# Altium project ESC.PrjPcb
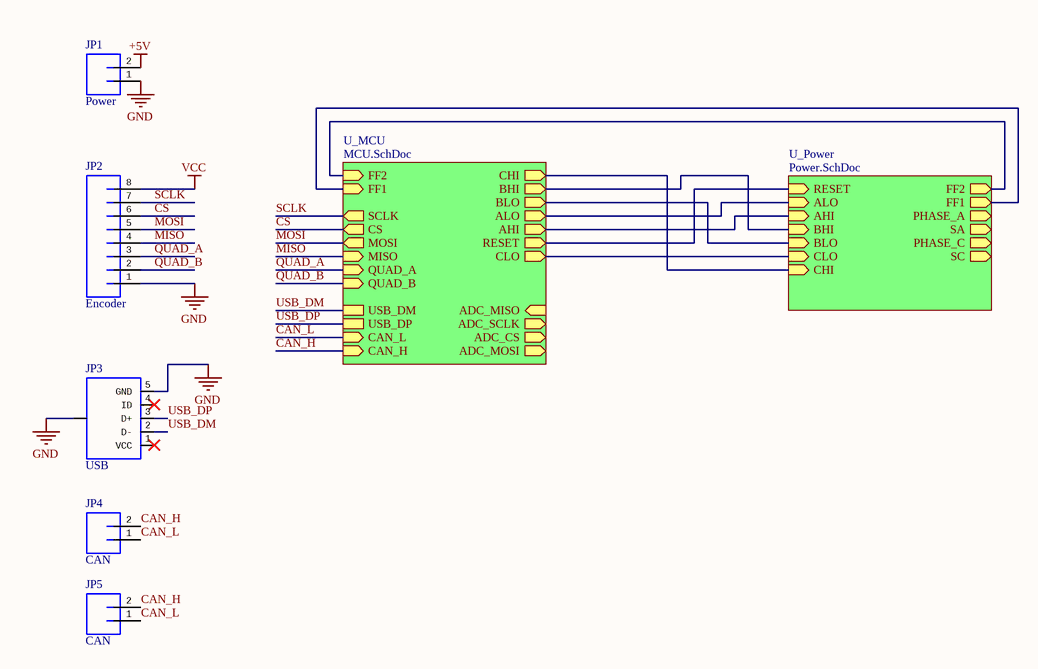
[diagram p0: ESC.SchDoc]
4 sheets, 85 parts. Net scope: hierarchical (ports join the sheet entries above them; power ports are global).
Board file: ESC.PcbDoc
Sheets:
  ESC.SchDoc
    U_Power = Power.SchDoc
    U_MCU = MCU.SchDoc
  ADC.SchDoc

## Sheet ESC.SchDoc
size A

### Parts
JP1  Power  [JST-2-PTH-VERT]
JP2  Encoder  [JST-8-PTH-VERT]
JP3  USB  [USB-MICROB]
JP4  CAN  [JST-2-PTH-VERT]
JP5  CAN  [JST-2-PTH-VERT]

### Sub-sheets
U_MCU = MCU.SchDoc: CHI (out), BHI (out), BLO (out), FF2 (in), FF1 (in), ALO (out), AHI (out), RESET (out), CLO (out), MISO (in), SCLK (out), CS (out), QUAD_A (in), QUAD_B (in), MOSI (out), ADC_MISO (in), ADC_SCLK (out), ADC_CS (out), ADC_MOSI (out), USB_DM, USB_DP, CAN_L (in), CAN_H (in)
U_Power = Power.SchDoc: RESET (in), FF2 (out), ALO (in), FF1 (out), AHI (in), BHI (in), BLO (in), CLO (in), CHI (in), PHASE_A (out), SA (out), SC (out), PHASE_C (out)

### Nets
+5V: JP1.2
GND: JP1.1 JP2.1 JP3.5(GND) JP3.6(SHIELD)
VCC: JP2.8
CAN_H: JP4.2 JP5.2 ; sheet U_MCU/CAN_H
CAN_L: JP4.1 JP5.1 ; sheet U_MCU/CAN_L
CS: JP2.6 ; sheet U_MCU/CS
MISO: JP2.4 ; sheet U_MCU/MISO
MOSI: JP2.5 ; sheet U_MCU/MOSI
QUAD_A: JP2.3 ; sheet U_MCU/QUAD_A
QUAD_B: JP2.2 ; sheet U_MCU/QUAD_B
SCLK: JP2.7 ; sheet U_MCU/SCLK
USB_DM: JP3.2(D-) ; sheet U_MCU/USB_DM
USB_DP: JP3.3(D+) ; sheet U_MCU/USB_DP
NetU1_2: sheet U_Power/RESET, sheet U_MCU/RESET
NetU1_4: sheet U_Power/FF2, sheet U_MCU/FF2
NetU1_5: sheet U_Power/FF1, sheet U_MCU/FF1
NetU1_6: sheet U_Power/ALO, sheet U_MCU/ALO
NetU1_7: sheet U_Power/AHI, sheet U_MCU/AHI
NetU1_8: sheet U_Power/BHI, sheet U_MCU/BHI
NetU1_9: sheet U_Power/BLO, sheet U_MCU/BLO
NetU1_10: sheet U_Power/CLO, sheet U_MCU/CLO
NetU1_11: sheet U_Power/CHI, sheet U_MCU/CHI

Not connected (* = marked no-connect by the designer): JP3 1(VCC)* 4(ID)*

### Library data of the parts
JP1 JP4 JP5 = JST_2_VERT
JP2 = JST_8_VERT
JP3 = USB_MICROB_PLUG-SMT: pin to pad: 1>VBUS 2>D- 3>D+ 4>ID 5>GND 6>MT1+P$1+P$2+MT2; PROD_ID: CONN-09900

## Sheet Power.SchDoc
size A
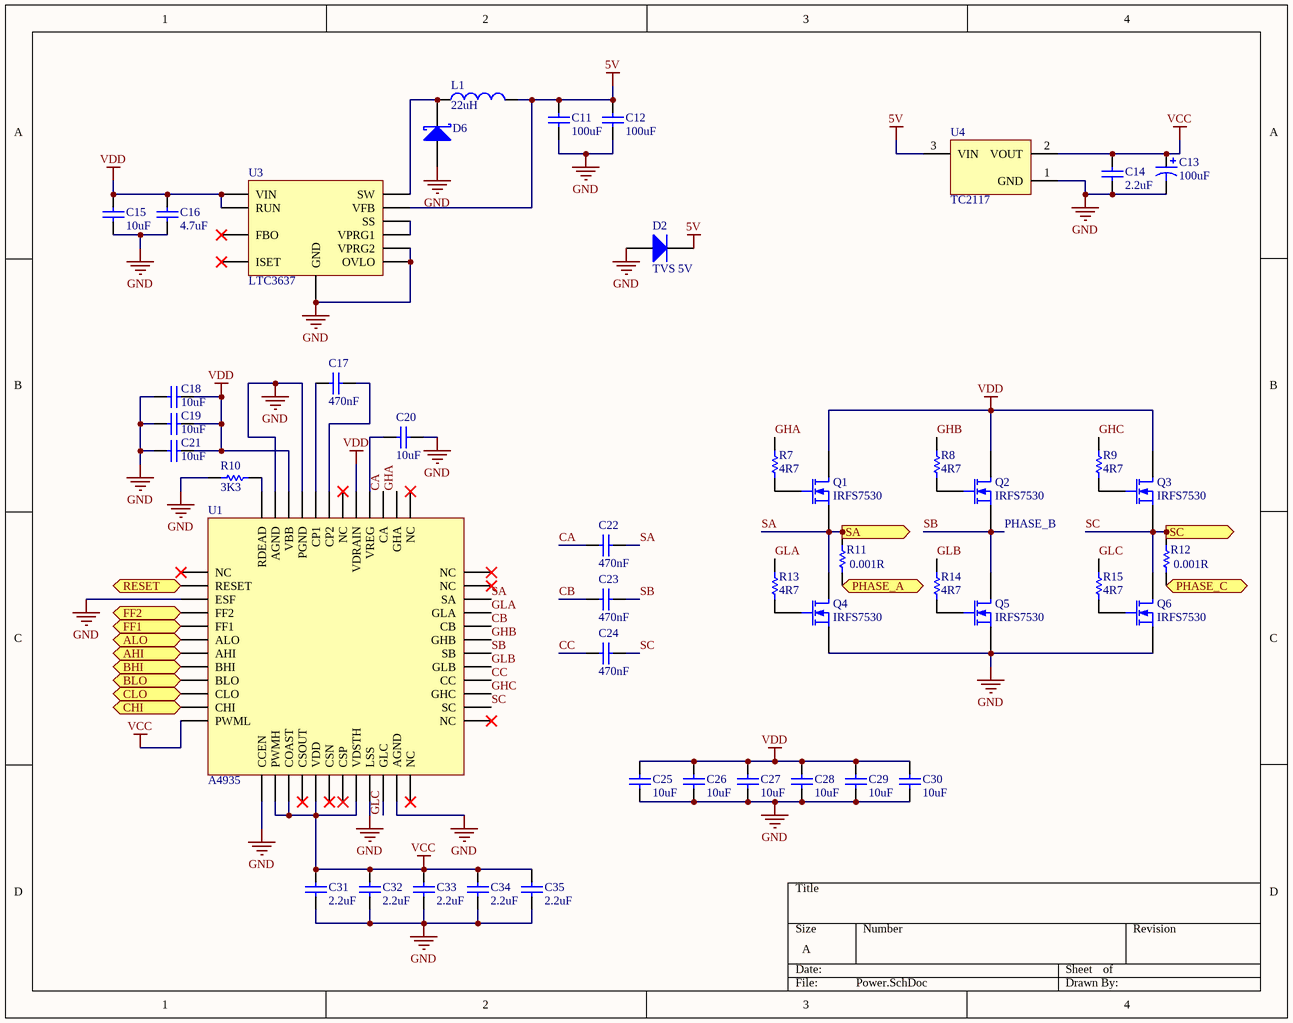
[diagram p1: Power.SchDoc]

### Parts
C11  100uF  [CAPC1210(3225)280_N]
C12  100uF  [CAPC1210(3225)280_N]
C13  100uF  [AVX-CAPC7343_V]
C14  2.2uF  [CAPC0603(1608)55_N]
C15  10uF  [CAPC1206(3216)190_M]
C16  4.7uF  [CAPC0805(2012)145_N]
C17  470nF  [CAPC0603(1608)100_N]
C18  10uF  [CAPC1206(3216)190_M]
C19  10uF  [CAPC1206(3216)190_M]
C20  10uF  [CAPC0805(2012)145_N]
C21  10uF  [CAPC1206(3216)190_M]
C22  470nF  [CAPC0603(1608)100_L]
C23  470nF  [CAPC0603(1608)100_L]
C24  470nF  [CAPC0603(1608)100_L]
C25  10uF  [CAPC1206(3216)190_M]
C26  10uF  [CAPC1206(3216)190_M]
C27  10uF  [CAPC1206(3216)190_M]
C28  10uF  [CAPC1206(3216)190_M]
C29  10uF  [CAPC1206(3216)190_M]
C30  10uF  [CAPC1206(3216)190_M]
C31  2.2uF  [CAPC0603(1608)55_N]
C32  2.2uF  [CAPC0603(1608)55_N]
C33  2.2uF  [CAPC0603(1608)55_N]
C34  2.2uF  [CAPC0603(1608)55_N]
C35  2.2uF  [CAPC0603(1608)55_N]
D2  TVS 5V  [VISH-DO-214AC-2_N]
D6  (no value)  [SMB]
L1  value 22uH  [SDR0805-180ML]  (hidden comment: SDR0805-180ML)
Q1  IRFS7530  [DPAK127P1525X483-7N]
Q2  IRFS7530  [DPAK127P1525X483-7N]
Q3  IRFS7530  [DPAK127P1525X483-7N]
Q4  IRFS7530  [DPAK127P1525X483-7N]
Q5  IRFS7530  [DPAK127P1525X483-7N]
Q6  IRFS7530  [DPAK127P1525X483-7N]
R7  4R7  [RESC0603(1608)_N]
R8  4R7  [RESC0603(1608)_N]
R9  4R7  [RESC0603(1608)_N]
R10  3K3  [RESC0603(1608)_N]
R11  value 0.001R  [Shunt]
R12  value 0.001R  [Shunt]
R13  4R7  [RESC0603(1608)_N]
R14  4R7  [RESC0603(1608)_N]
R15  4R7  [RESC0603(1608)_N]
U1  A4935  [LQFP-48]
U3  LTC3637  [SON50P300X85_HS-17N]
U4  TC2117  [SOT-223-DB3_M]

### Ports
AHI (in), ALO (in), BHI (in), BLO (in), CHI (in), CLO (in), FF1 (out), FF2 (out), PHASE_A (out), PHASE_C (out), RESET (in), SA (out), SC (out)

### Nets
5V: C11.2 C12.2 D2.1(K) L1.2 U3.9(VFB) U4.3(VIN)
GND: C11.1 C12.1 C13.2 C14.2 C15.1 C16.2 C18.1 C19.1 C20.2 C21.1 C25.1 C26.1 C27.1 C28.1 C29.1 C30.1 C31.1 C32.1 C33.1 C34.1 C35.1 D2.2(A) D6.1(A) Q4.3(S) Q5.3(S) Q6.3(S) R10.1 U1.3(ESF) U1.13(CCEN) U1.21(LSS) U1.23(AGND) U1.45(PGND) U1.47(AGND) U3.6(VPRG2) U3.12(OVLO) U3.17(GND) U4.1(GND)
VCC: C13.1 C14.1 C31.2 C32.2 C33.2 C34.2 C35.2 U1.12(PWML) U1.14(PWMH) U1.15(COAST) U1.17(VDD) U1.20(VDSTH) U4.2(VOUT)
VDD: C15.2 C16.1 C18.2 C19.2 C21.2 C25.2 C26.2 C27.2 C28.2 C29.2 C30.2 Q1.1(D) Q2.1(D) Q3.1(D) U1.41(VDRAIN) U1.46(VBB) U3.3(VIN) U3.14(RUN)
CA: C22.1 U1.39(CA)
CB: C23.1 U1.32(CB)
CC: C24.1 U1.28(CC)
GHA: R7.2 U1.38(GHA)
GHB: R8.2 U1.31(GHB)
GHC: R9.2 U1.27(GHC)
GLA: R13.2 U1.33(GLA)
GLB: R14.2 U1.29(GLB)
GLC: R15.2 U1.22(GLC)
SA: C22.2 Q1.3(S) Q4.1(D) R11.2 U1.34(SA) ; port SA
SB: C23.2 Q2.3(S) Q5.1(D) U1.30(SB)
SC: C24.2 Q3.3(S) Q6.1(D) R12.2 U1.26(SC) ; port SC
NetC17_1: C17.1 U1.44(CP1)
NetC17_2: C17.2 U1.43(CP2)
NetC20_1: C20.1 U1.40(VREG)
NetD6_2: D6.2(K) L1.1 U3.1(SW)
NetQ1_2: Q1.2(G) R7.1
NetQ2_2: Q2.2(G) R8.1
NetQ3_2: Q3.2(G) R9.1
NetQ4_2: Q4.2(G) R13.1
NetQ5_2: Q5.2(G) R14.1
NetQ6_2: Q6.2(G) R15.1
NetR10_2: R10.2 U1.48(RDEAD)
NetR11_1: R11.1 ; port PHASE_A
NetR12_1: R12.1 ; port PHASE_C
NetU1_2: U1.2(RESET) ; port RESET
NetU1_4: U1.4(FF2) ; port FF2
NetU1_5: U1.5(FF1) ; port FF1
NetU1_6: U1.6(ALO) ; port ALO
NetU1_7: U1.7(AHI) ; port AHI
NetU1_8: U1.8(BHI) ; port BHI
NetU1_9: U1.9(BLO) ; port BLO
NetU1_10: U1.10(CLO) ; port CLO
NetU1_11: U1.11(CHI) ; port CHI
NetU3_7: U3.7(VPRG1) U3.10(SS)

Not connected (* = marked no-connect by the designer): U1 1(NC)* 16(CSOUT)* 18(CSN)* 19(CSP)* 24(NC)* 25(NC)* 35(NC)* 36(NC)* 37(NC)* 42(NC)*; U3 5(FBO)* 11(ISET)*

### Notes on the sheet
- (near Q2) PHASE_B

### Library data of the parts
C11 C12 = CMP-1038-02301-1: CAP 100uF 10V Â±10% 1210 (3225 Metric) Thickness 2.8mm SMD; Case-EIA: 1210; Case-Metric: 3225; Rated Voltage: 6.3 V; Value: 100uF; Tolerance: Â±10%; Technology: SMT; Max Thickness: 2.8 mm
C13 = AVX-CAP-P-2
C14 C31-C35 = CMP-1035-02762-1: CAP 2.2uF 16V Â±10% 0603 (1608 Metric) Thickness 0.55mm SMD; Case-EIA: 0603; Case-Metric: 1608; Max Thickness: 0.55 mm; Technology: SMT; Value: 2.2uF; Rated Voltage: 16 V; Tolerance: Â±10%
C15 C18 C19 C21 C25-C30 = CMP-1037-04982-1: CAP 10uF 50V Â±10% 1206 (3216 Metric) Thickness 1.9mm SMD; Case-EIA: 1206; Case-Metric: 3216; Technology: SMT; Tolerance: Â±10%; Max Thickness: 1.9 mm; Value: 10uF; Rated Voltage: 50 V
C16 = CMP-1036-04900-1: CAP 4.7uF 50V Â±10% 0805 (2012 Metric) Thickness 1.45mm SMD; Case-Metric: 2012; Case-EIA: 0805; Value: 4.7uF; Tolerance: Â±10%; Technology: SMT; Max Thickness: 1.45 mm; Rated Voltage: 50 V
C17 = CMP-1035-02704-1: CAP 470nF 25V Â±20% 0603 (1608 Metric) Thickness 1mm SMD; Case-Metric: 1608; Case-EIA: 0603; Technology: SMT; Rated Voltage: 25 V; Max Thickness: 1 mm; Value: 470nF; Tolerance: Â±20%
C20 = CMP-1036-04932-1: CAP 10uF 25V Â±10% 0805 (2012 Metric) Thickness 1.45mm SMD; Case-EIA: 0805; Case-Metric: 2012; Technology: SMT; Value: 10uF; Rated Voltage: 25 V; Max Thickness: 1.45 mm; Tolerance: Â±10%
C22-C24 = CMP-1035-02703-1: CAP 470nF 25V Â±10% 0603 (1608 Metric) Thickness 1mm SMD; Case-Metric: 1608; Case-EIA: 0603; Tolerance: Â±10%; Rated Voltage: 25 V; Max Thickness: 1 mm; Technology: SMT; Value: 470nF
D2 = CMP-0548-00235-1: Transient Voltage Suppressor, 6.40 to 231 V, 5 V Stand-off Voltage, Uni-Directional, -55 to 155 degC, 2-pin DO-214AC, Pb-Free, Tape and Reel; PartNumber: SMAJ5.0A-E3/61; Manufacturer: Vishay Semiconductor; ID (uA): 800; IFSM: 40 A; VBR Uni-Directional (V): 6.4 to 231; PPPM (W): 400, 300; VWM (V): 5; PackageDescription: 2-Pin DO-214AC (SMA), Body 4.245 x 2.665 mm; Mounting Technology: Surface Mount; ComponentLink3Description: Package Specification; ComponentLink1URL: http://www.vishay.com/; Operating Junction and Storage Temperature Range: -55 to 150 degC; PackageReference: DO-214AC-2; ComponentLink2URL: http://www.vishay.com/docs/88390/smaj50a.pdf; Packing: Tape and Reel; RoHS: TRUE; DatasheetVersion: 12/8/2013; ComponentLink3URL: http://www.vishay.com/docs/88390/smaj50a.pdf; ComponentLink1Description: Manufacturer URL; ComponentLink2Description: Datasheet
D6 = D Schottky: Schottky Diode; Published: 8-Jun-2000; LatestRevisionDate: 17-Jul-2002; LatestRevisionNote: Re-released for DXP Platform.; PackageReference: SMB; Publisher: Altium Limited; PackageDescription: DO-214-AA/SMB; 2 C-Bend Leads; Body 5.3 x 3.6 mm, inc. leads (LxW); Code_JEDEC: DO-214-AA
L1 = SDR0805-180ML: Inductor; Code_IEC: 1005; Published: 8-Jun-2000; LatestRevisionDate: 29-May-2009; LatestRevisionNote: IPC-7351 Footprint Added.; PackageReference: 0402-A; Publisher: Altium Limited; PackageDescription: Chip Inductor; Code_JEITA: 0402
Q1-Q6 = IRFS7530: N-Channel MOSFET; pin to pad: 1>8 2>1 3>2+3+5+6+7; Published: 8-Jun-2000; LatestRevisionDate: 17-Jul-2002; LatestRevisionNote: Re-released for DXP Platform.; PackageVersion: 1995/1996; PackageReference: E3; Publisher: Altium Limited; PackageDescription: TO, Flat Index; 3 In-Line, Axial Leads; Body Dia. 4.6mm; Lead Dia. 0.5 mm (max)
R7-R9 R13-R15 = CMP-1012-00018-1: 4R7 0.1W 5% 0603 (1608 Metric)  SMD; Value: 4.70 Ohm; Case-EIA: 0603; Case-Metric: 1608; Power: 0.1 W; Tolerance: 5 %; Technology: SMT
R10 = CMP-1012-00086-1: 3K3 0.1W 5% 0603 (1608 Metric)  SMD; Case-EIA: 0603; Value: 3300.00 Ohm; Case-Metric: 1608; Technology: SMT; Tolerance: 5 %; Power: 0.1 W
R11 = Shunt: 0.001R; Published: 8-Jun-2000; LatestRevisionDate: 17-Jul-2002; LatestRevisionNote: Re-released for DXP Platform.; PackageReference: AXIAL-0.3; Publisher: Altium Limited; PackageDescription: Axial Device, Thru-Hole; 2 Leads; 0.3 in Pin Spacing
R12 = Shunt: Resistor; Published: 8-Jun-2000; LatestRevisionDate: 17-Jul-2002; LatestRevisionNote: Re-released for DXP Platform.; PackageReference: AXIAL-0.3; Publisher: Altium Limited; PackageDescription: Axial Device, Thru-Hole; 2 Leads; 0.3 in Pin Spacing
U1 = A4935: pin to pad: 23>23+47+49 47>47+23+49
U3 = LTC3637: pin to pad: 17>8+16+17
U4 = PM-LINEREG-TC2117-IL4: pin to pad: 2>2+4

## Sheet MCU.SchDoc
size A
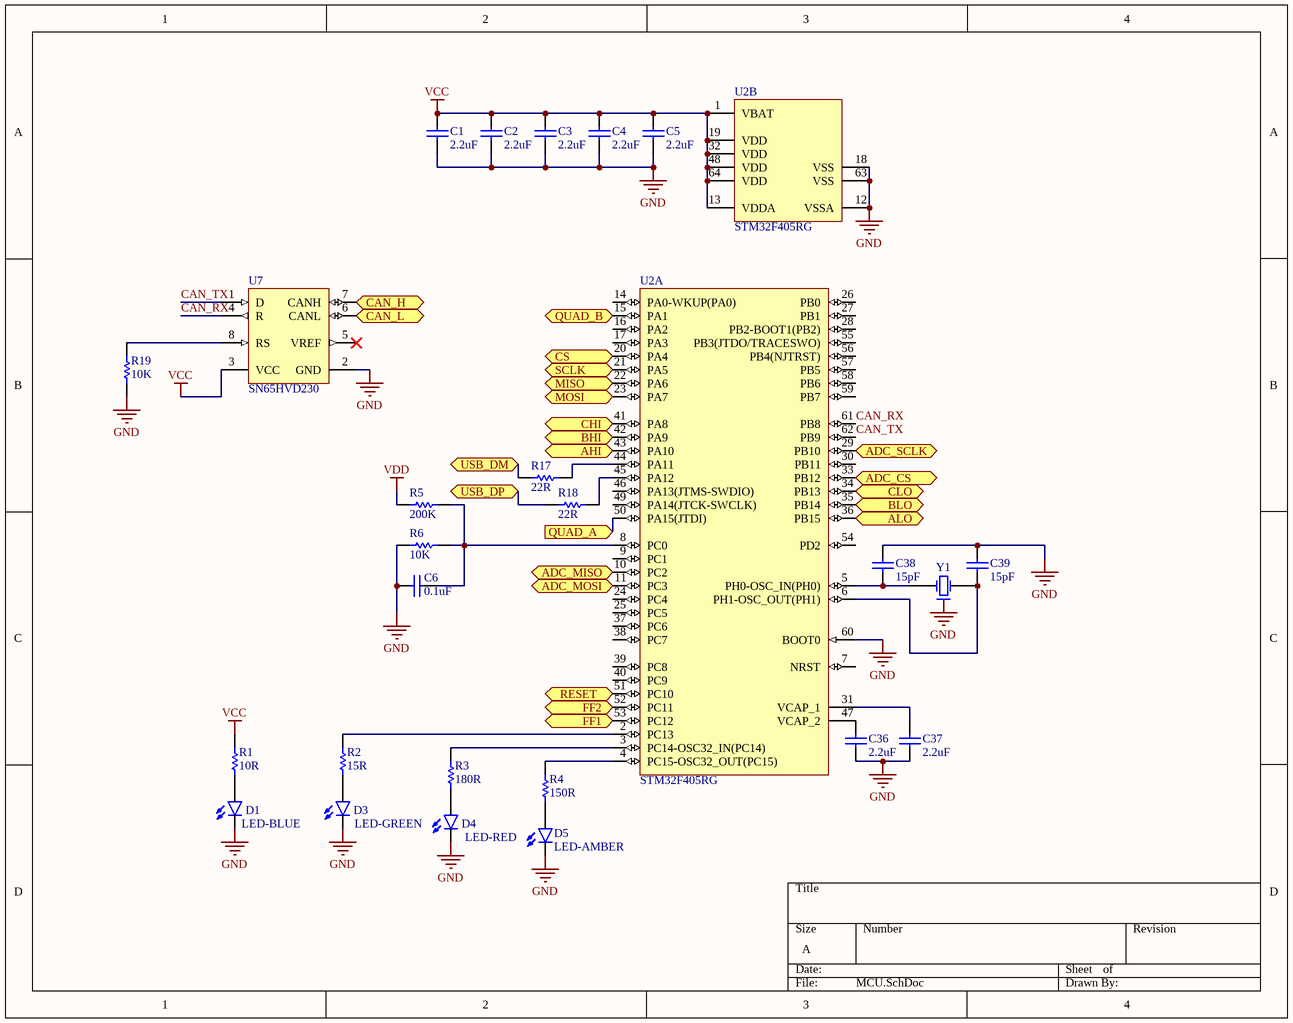
[diagram p2: MCU.SchDoc]

### Parts
C1  2.2uF  [CAPC0603(1608)55_N]
C2  2.2uF  [CAPC0603(1608)55_N]
C3  2.2uF  [CAPC0603(1608)55_N]
C4  2.2uF  [CAPC0603(1608)55_N]
C5  2.2uF  [CAPC0603(1608)55_N]
C6  0.1uF  [CAPC0603(1608)100_L]
C36  2.2uF  [CAPC0603(1608)55_N]
C37  2.2uF  [CAPC0603(1608)55_N]
C38  15pF  [CAPC0603(1608)100_M]
C39  15pF  [CAPC0603(1608)100_M]
D1  LED-BLUE  [LED-1206]
D3  LED-GREEN  [LED-1206]
D4  LED-RED  [LED-1206]
D5  LED-AMBER  [LED-1206]
R1  10R  [RESC0603(1608)_N]
R2  15R  [RESC0603(1608)_N]
R3  180R  [RESC0603(1608)_N]
R4  150R  [RESC0603(1608)_N]
R5  200K  [RESC0603(1608)_N]
R6  10K  [RESC0603(1608)_N]
R17  22R  [RESC0603(1608)_N]
R18  22R  [RESC0603(1608)_N]
R19  10K  [RESC0603(1608)_N]
U2  STM32F405RG  (parts A,B of 2)
U7  SN65HVD230  [D8_M]
Y1  (no value)  [ABRA-ABM3B-4_V]

### Ports
ADC_CS (out), ADC_MISO (in), ADC_MOSI (out), ADC_SCLK (out), AHI (out), ALO (out), BHI (out), BLO (out), CAN_H (in), CAN_L (in), CHI (out), CLO (out), CS (out), FF1 (in), FF2 (in), MISO (in), MOSI (out), QUAD_A (in), QUAD_B (in), RESET (out), SCLK (out), USB_DM, USB_DP

### Nets
GND: C1.1 C2.1 C3.1 C4.1 C5.1 C6.1 C36.1 C37.1 C38.2 C39.2 D1.C D3.C D4.C D5.C R6.1 R19.1 U2.12(VSSA) U2.18(VSS) U2.60(BOOT0) U2.63(VSS) U7.2(GND) Y1.2
VCC: C1.2 C2.2 C3.2 C4.2 C5.2 R1.2 U2.1(VBAT) U2.13(VDDA) U2.19(VDD) U2.32(VDD) U2.48(VDD) U2.64(VDD) U7.3(VCC)
VDD: R5.1
CAN_H: U7.7(CANH) ; port CAN_H
CAN_L: U7.6(CANL) ; port CAN_L
CAN_RX: U2.61(PB8) U7.4(R)
CAN_TX: U2.62(PB9) U7.1(D)
CS: U2.20(PA4) ; port CS
MISO: U2.22(PA6) ; port MISO
MOSI: U2.23(PA7) ; port MOSI
QUAD_A: U2.50(PA15(JTDI)) ; port QUAD_A
QUAD_B: U2.15(PA1) ; port QUAD_B
SCLK: U2.21(PA5) ; port SCLK
USB_DM: R17.1 ; port USB_DM
USB_DP: R18.1 ; port USB_DP
NetC6_2: C6.2 R5.2 R6.2 U2.8(PC0)
NetC36_2: C36.2 U2.47(VCAP_2)
NetC37_2: C37.2 U2.31(VCAP_1)
NetC38_1: C38.1 U2.5(PH0-OSC_IN(PH0)) Y1.1(X1)
NetC39_1: C39.1 U2.6(PH1-OSC_OUT(PH1)) Y1.3(X2)
NetD1_A: D1.A R1.1
NetD3_A: D3.A R2.1
NetD4_A: D4.A R3.1
NetD5_A: D5.A R4.1
NetR2_2: R2.2 U2.2(PC13)
NetR3_2: R3.2 U2.3(PC14-OSC32_IN(PC14))
NetR4_2: R4.2 U2.4(PC15-OSC32_OUT(PC15))
NetR17_2: R17.2 U2.44(PA11)
NetR18_2: R18.2 U2.45(PA12)
NetR19_2: R19.2 U7.8(RS)
NetU1_2: U2.51(PC10) ; port RESET
NetU1_4: U2.52(PC11) ; port FF2
NetU1_5: U2.53(PC12) ; port FF1
NetU1_6: U2.36(PB15) ; port ALO
NetU1_7: U2.43(PA10) ; port AHI
NetU1_8: U2.42(PA9) ; port BHI
NetU1_9: U2.35(PB14) ; port BLO
NetU1_10: U2.34(PB13) ; port CLO
NetU1_11: U2.41(PA8) ; port CHI
NetU2_10: U2.10(PC2) ; port ADC_MISO
NetU2_11: U2.11(PC3) ; port ADC_MOSI
NetU2_29: U2.29(PB10) ; port ADC_SCLK
NetU2_33: U2.33(PB12) ; port ADC_CS

Not connected (* = marked no-connect by the designer): U2 7(NRST) 9(PC1) 14(PA0-WKUP(PA0)) 16(PA2) 17(PA3) 24(PC4) 25(PC5) 26(PB0) 27(PB1) 28(PB2-BOOT1(PB2)) 30(PB11) 37(PC6) 38(PC7) 39(PC8) 40(PC9) 46(PA13(JTMS-SWDIO)) 49(PA14(JTCK-SWCLK)) 54(PD2) 55(PB3(JTDO/TRACESWO)) 56(PB4(NJTRST)) 57(PB5) 58(PB6) 59(PB7); U7 5(VREF)*

### Library data of the parts
C1-C5 C36 C37 = CMP-1035-02762-1: as C14 on sheet Power; Max Thickness: 0.55 mm; Technology: SMT; Value: 2.2uF; Rated Voltage: 16 V; Tolerance: Â±10%
C6 = CMP-1035-02591-1: CAP 100nF 50V Â±5% 0603 (1608 Metric) Thickness 1mm SMD; Case-Metric: 1608; Case-EIA: 0603; Rated Voltage: 50 V; Max Thickness: 1 mm; Tolerance: Â±5%; Technology: SMT; Value: 100nF
C38 C39 = CMP-1035-00686-1: CAP 15pF 100V Â±0.25pF 0603 (1608 Metric) Thickness 1mm SMD; Case-Metric: 1608; Case-EIA: 0603; Rated Voltage: 100 V; Max Thickness: 1 mm; Value: 15pF; Tolerance: Â±0.25pF; Technology: SMT
D1 = LED-BLUE1206: PROD_ID: DIO-09911
D3 = LED-GREEN1206: PROD_ID: DIO-00862
D4 = LED-RED1206: PROD_ID: DIO-09912
D5 = LED-AMBER1206
R1 = CMP-1012-00026-1: 10R 0.1W 5% 0603 (1608 Metric)  SMD; Case-Metric: 1608; Case-EIA: 0603; Value: 10.00 Ohm; Technology: SMT; Tolerance: 5 %; Power: 0.1 W
R2 = CMP-1012-00030-1: 15R 0.1W 5% 0603 (1608 Metric)  SMD; Case-EIA: 0603; Case-Metric: 1608; Value: 15.00 Ohm; Tolerance: 5 %; Technology: SMT; Power: 0.1 W
R3 = CMP-1012-00056-1: 180R 0.1W 5% 0603 (1608 Metric)  SMD; Value: 180.00 Ohm; Case-EIA: 0603; Case-Metric: 1608; Power: 0.1 W; Technology: SMT; Tolerance: 5 %
R4 = CMP-1012-00054-1: 150R 0.1W 5% 0603 (1608 Metric)  SMD; Case-EIA: 0603; Value: 150.00 Ohm; Case-Metric: 1608; Power: 0.1 W; Tolerance: 5 %; Technology: SMT
R5 = CMP-1012-00129-1: 200K 0.1W 5% 0603 (1608 Metric)  SMD; Case-EIA: 0603; Value: 200000.00 Ohm; Case-Metric: 1608; Technology: SMT; Power: 0.1 W; Tolerance: 5 %
R6 R19 = CMP-1012-00098-1: 10K 0.1W 5% 0603 (1608 Metric)  SMD; Case-EIA: 0603; Value: 10000.00 Ohm; Case-Metric: 1608; Technology: SMT; Tolerance: 5 %; Power: 0.1 W
R17 R18 = CMP-1012-00034-1: 22R 0.1W 5% 0603 (1608 Metric)  SMD; Value: 22.00 Ohm; Case-EIA: 0603; Case-Metric: 1608; Technology: SMT; Power: 0.1 W; Tolerance: 5 %
U2 = MC-ARM-STM32F4X5-SQ64
U7 = CMP-0315-00015-1: 3.3V CAN Transceiver with Standby Mode, 17 mA, -40 to 85 degC, 8-pin SOIC (D), Green (RoHS & no Sb/Br); Manufacturer: Texas Instruments; PartNumber: SN65HVD230DR; ICC(Max)(mA): 17; Supply Voltage(s)(V): 3.3; Drivers Per Package: 1; Transient Pulse Protection(V): -25 to 25; Rating: Catalog; Code_JEDEC: MS-012AA; Low Power Mode: Standby; PackageDescription: 8-Pin Plastic Small Outline Integrated Circuit, 4.9 x 3.9 mm, Pitch 1.27 mm Pitch; PackageReference: D8; DatasheetVersion: SLOS346K; Isolated: No; Receivers Per Package: 1; PackageVersion: revM, Jun-2011; Eco-Plan: Green (RoHS & no Sb/Br); SubFamily: CAN; ComponentLink1Description: Datasheet; Footprint: PCA82C250; Mounting Technology: Surface Mount; ComponentLink1URL: http://www.ti.com/general/docs/lit/getliterature.tsp?genericPartNumber=SN65HVD230&fileType=pdf
Y1 = ABRA-ABM3B-4

## Sheet ADC.SchDoc
size A
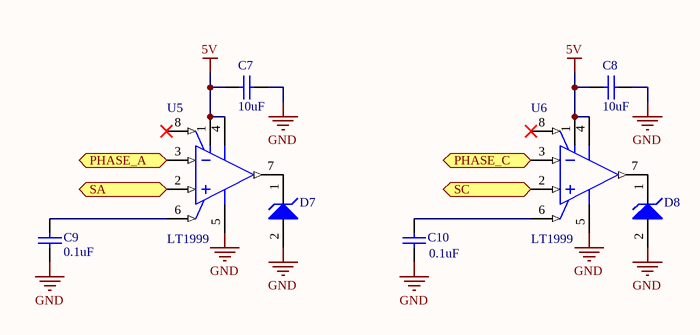
[diagram p3: ADC.SchDoc]

### Parts
C7  10uF  [CAPC0603(1608)100_M]
C8  10uF  [CAPC0603(1608)100_N]
C9  0.1uF  [CAPC0603(1608)100_L]
C10  0.1uF  [CAPC0603(1608)100_L]
D7  (no value)  [ONSC-SOD-323-2-477-02_V]
D8  (no value)  [ONSC-SOD-323-2-477-02_V]
U5  LT1999  [LT-MS8-8_N]
U6  LT1999  [LT-MS8-8_N]

### Ports
PHASE_A (in), PHASE_C (in), SA (in), SC (in)

### Nets
5V: C7.1 C8.1 U5.1(V+) U5.4(V+) U6.1(V+) U6.4(V+)
GND: C7.2 C8.2 C9.1 C10.1 D7.2(A) D8.2(A) U5.5(GND) U6.5(GND)
NetC9_2: C9.2 U5.6(REF)
NetC10_2: C10.2 U6.6(REF)
NetD7_1: D7.1(K) U5.7(OUT)
NetD8_1: D8.1(K) U6.7(OUT)
NetU5_2: U5.2(+IN) ; port SA
NetU5_3: U5.3(-IN) ; port PHASE_A
NetU6_2: U6.2(+IN) ; port SC
NetU6_3: U6.3(-IN) ; port PHASE_C

Not connected (* = marked no-connect by the designer): U5 8(~{SHDN})*; U6 8(~{SHDN})*

### Library data of the parts
C7 = CMP-1035-02796-1: CAP 10uF 6.3V Â±10% 0603 (1608 Metric) Thickness 1mm SMD; Case-EIA: 0603; Case-Metric: 1608; Tolerance: Â±10%; Value: 10uF; Technology: SMT; Rated Voltage: 6.3 V; Max Thickness: 1 mm
C8 = CMP-1035-02797-1: CAP 10uF 6.3V Â±20% 0603 (1608 Metric) Thickness 1mm SMD; Case-Metric: 1608; Case-EIA: 0603; Value: 10uF; Technology: SMT; Tolerance: Â±20%; Max Thickness: 1 mm; Rated Voltage: 6.3 V
C9 C10 = CMP-1035-02577-1: CAP 100nF 6.3V Â±20% 0603 (1608 Metric) Thickness 1mm SMD; Case-EIA: 0603; Case-Metric: 1608; Technology: SMT; Rated Voltage: 6.3 V; Value: 100nF; Max Thickness: 1 mm; Tolerance: Â±20%
D7 D8 = CMP-1060-00652-1: Zener Voltage Regulator, 300 mW, Tight Tolerance Portfolio, 2-Pin SOD-323, Pb-Free, Tape and Reel; PartNumber: MM3Z3V3ST1G; Manufacturer: On Semiconductor; P Max (W): 0.3; DatasheetVersion: Rev. 21; PackageVersion: Rev. H, 03/2007; Packing: Tape and Reel; PackageReference: SOD-323-2-477-02; RoHS: Pb-Free; Mounting Technology: Surface Mount; ComponentLink2URL: http://www.onsemi.cn/pub_link/Collateral/MM3Z2V4ST1-D.PDF; ComponentLink1URL: http://www.onsemi.com/; ComponentLink2Description: Datasheet; ComponentLink1Description: Manufacturer URL; ComponentLink3Description: Package Specification; PackageDescription: 2-Pin SOD, Body 1.7 x 1.25 mm; ComponentLink3URL: http://www.onsemi.com/pub_link/Collateral/477-02.PDF.1
U5 U6 = CMP-0359-00619-2: Single Channel, High Voltage, Bidirectional Current Sense Amplifier, 2 MHz Typical GBW, 3 V/us Typical SR, 4.5 to 5.5 V, 8-Pin SOP (MS8-8), High Temperature / Automotive, Pb-Free, Reel; Manufacturer: Linear Technology; PartNumber: LT1999HMS8-20#TRPBF; Linear Technology Part Number: LT1999-20; Is (mA) Typical: 1.55; SR (V/us) Typical: 3; Channels (#): 1; Vs Max (V): 5.5; GBW (MHz) Typical: 2; Vs Min (V): 4.5; Vos (mV) Typical: 0.5; ComponentLink2Description: Datasheet; DatasheetVersion: Rev. B; PackageVersion: Rev G; ComponentLink3Description: Package Specification; ComponentLink2URL: http://cds.linear.com/docs/en/datasheet/1999fb.pdf; PackageReference: LT-MS8-8; PackageDescription: 8-Lead Plastic Small Outline, Body 3.9 x 4.9 mm, Pitch 1.27 mm; RevisionNote: URLs updated; Type: CSA; RoHS: Pb-Free; ComponentLink1URL: http://www.linear.com/; Packing: Reel; ComponentLink3URL: http://cds.linear.com/docs/en/packaging/05081610_G_SO8.pdf; ComponentLink1Description: Manufacturer URL; Mounting Technology: Surface Mount

## Nets that join several sheets
5V: Power (6 pins), ADC (6 pins)
GND: ESC (JP1.1 JP2.1 JP3.5 JP3.6), Power (37 pins), MCU (22 pins), ADC (8 pins)
VCC: ESC (JP2.8), Power (13 pins), MCU (13 pins)
VDD: Power (18 pins), MCU (R5.1)
CAN_H: ESC (JP4.2 JP5.2), MCU (U7.7)
CAN_L: ESC (JP4.1 JP5.1), MCU (U7.6)
CS: ESC (JP2.6), MCU (U2.20)
MISO: ESC (JP2.4), MCU (U2.22)
MOSI: ESC (JP2.5), MCU (U2.23)
NetU1_2: Power (U1.2), MCU (U2.51)
NetU1_4: Power (U1.4), MCU (U2.52)
NetU1_5: Power (U1.5), MCU (U2.53)
NetU1_6: Power (U1.6), MCU (U2.36)
NetU1_7: Power (U1.7), MCU (U2.43)
NetU1_8: Power (U1.8), MCU (U2.42)
NetU1_9: Power (U1.9), MCU (U2.35)
NetU1_10: Power (U1.10), MCU (U2.34)
NetU1_11: Power (U1.11), MCU (U2.41)
QUAD_A: ESC (JP2.3), MCU (U2.50)
QUAD_B: ESC (JP2.2), MCU (U2.15)
SCLK: ESC (JP2.7), MCU (U2.21)
USB_DM: ESC (JP3.2), MCU (R17.1)
USB_DP: ESC (JP3.3), MCU (R18.1)